# EAGLE schematic 030Card (EAGLE 8.2.2)
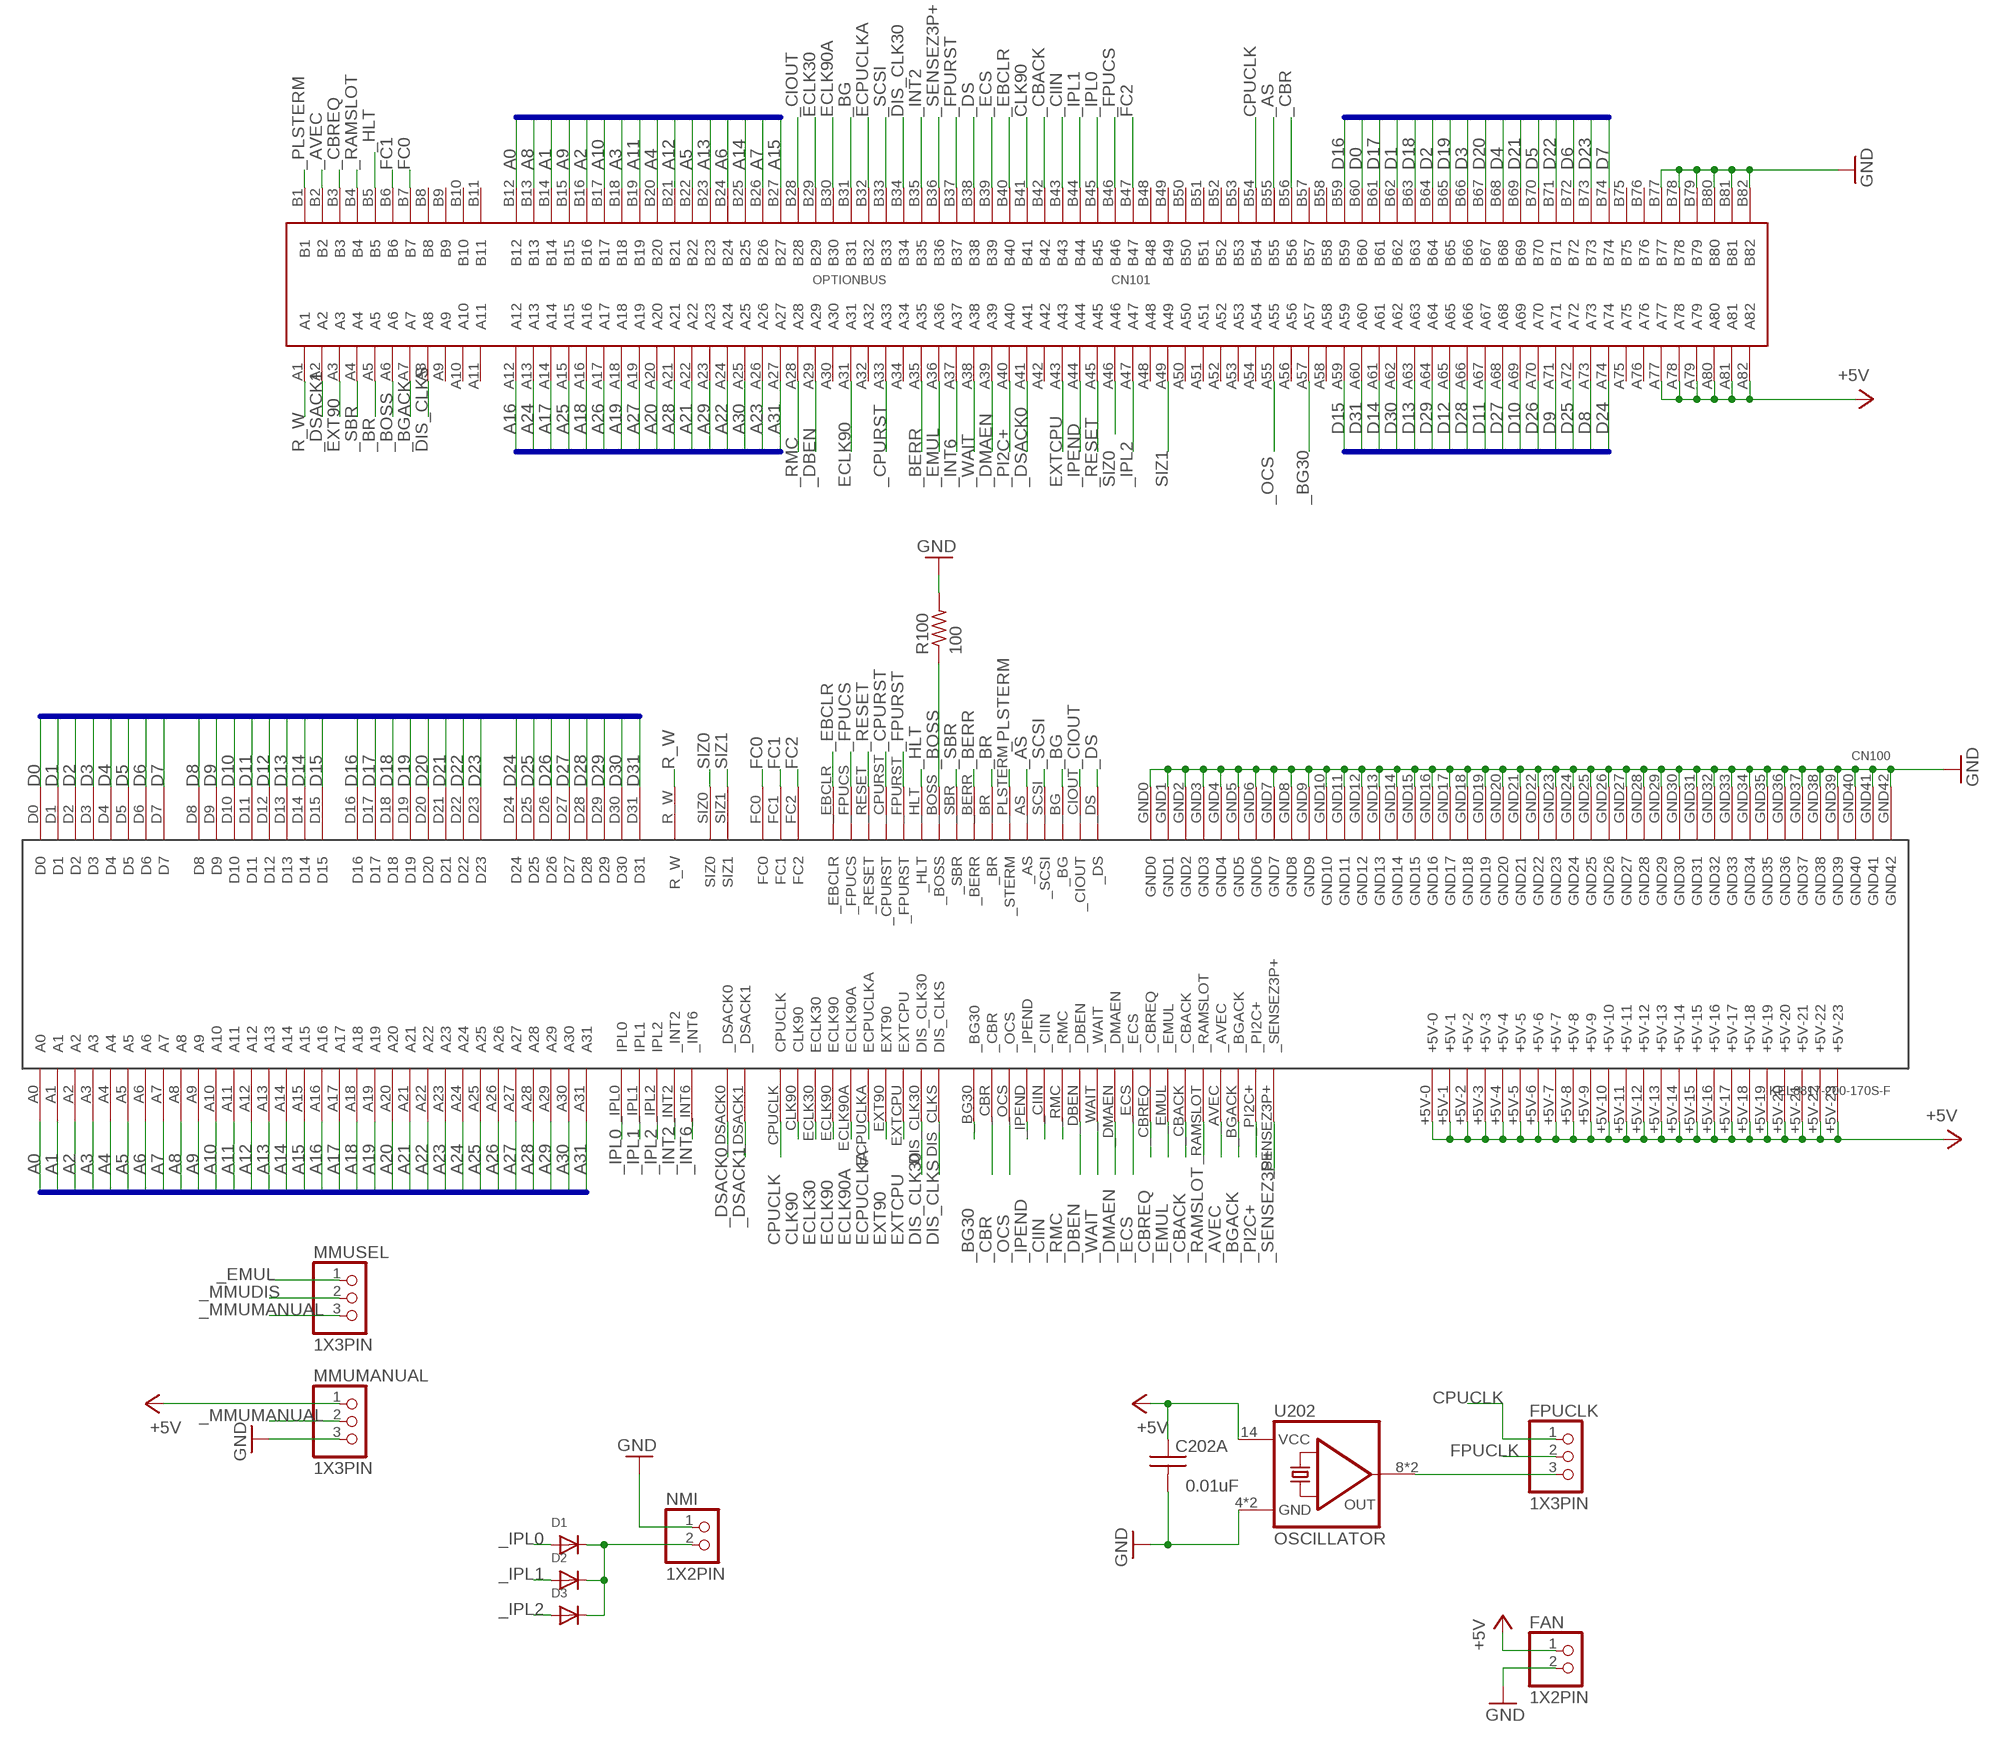
[diagram p0: schematic, sheet 1, part 1 of 2]
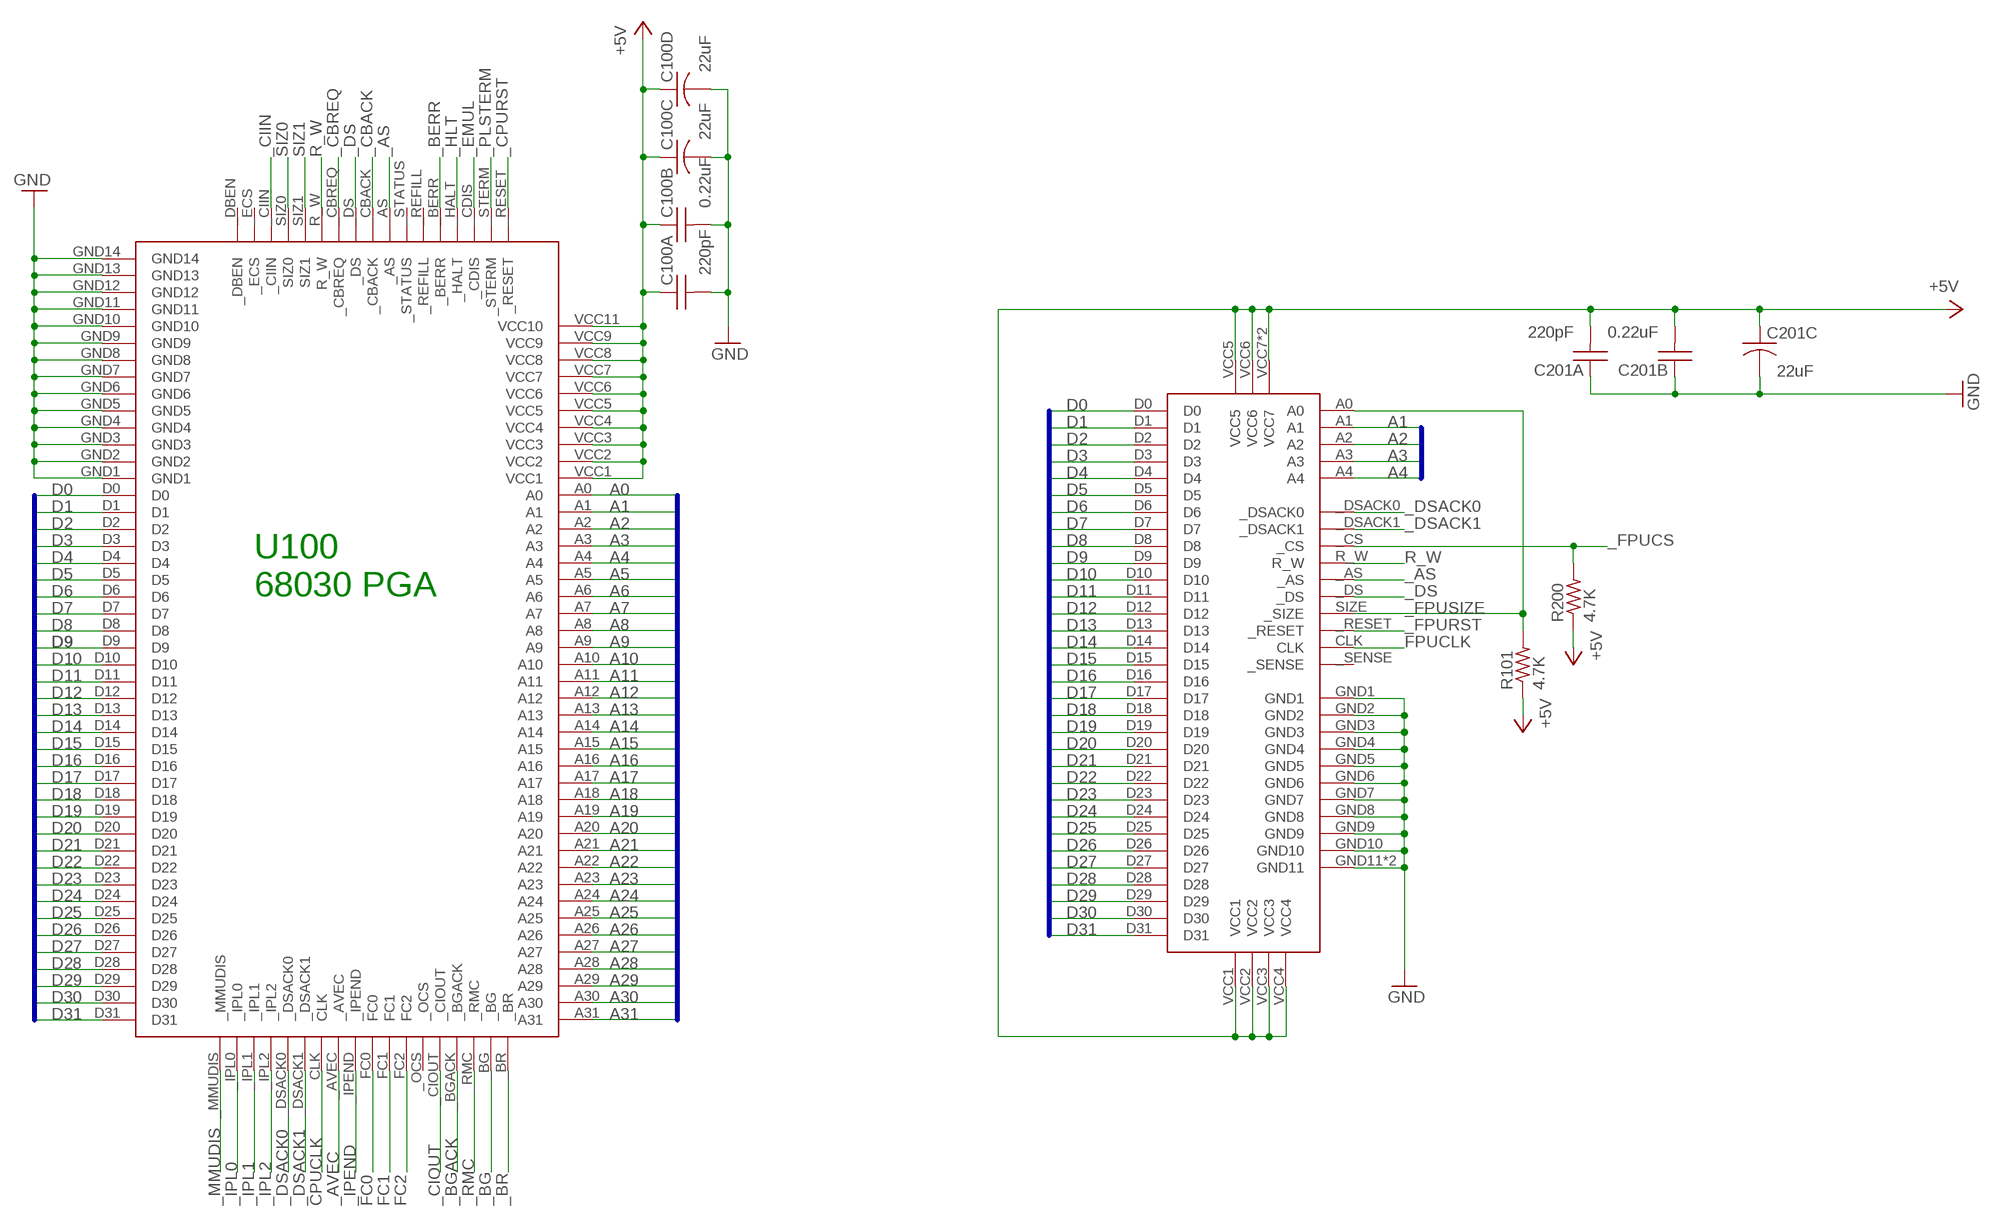
[diagram p1: schematic, sheet 1, part 2 of 2]

## Parts
C100A  220pF  C0805  [R0805]
C100B  0.22uF  C0805  [R0805]
C100C  22uF  SMD-ELECTROLYTE  [SMD-ELECTROLYTE]
C100D  22uF  SMD-ELECTROLYTE  [SMD-ELECTROLYTE]
C201A  220pF  C0805  [R0805]
C201B  0.22uF  C0805  [R0805]
C201C  22uF  SMD-ELECTROLYTE  [SMD-ELECTROLYTE]
C202A  0.01uF  C0805  [R0805]
CN100  KEL8817-200-170S-F  [KEL8817-200-170S-F]
CN101  OPTIONBUS  [OPTIONBUS]
D1  DIODESOD-323F  [SOD-323F]
D2  DIODESOD-323F  [SOD-323F]
D3  DIODESOD-323F  [SOD-323F]
FAN  1X2PIN  [1X2PIN]
FPUCLK  1X3PIN  [1X3PIN]
MMUMANUAL  1X3PIN  [1X3PIN]
MMUSEL  1X3PIN  [1X3PIN]
NMI  1X2PIN  [1X2PIN]
R100  100  R-US_R0805  [R0805]
R101  4.7K  R-US_R0805  [R0805]
R200  4.7K  R-US_R0805  [R0805]
U100  M68030  [M68030]
U201  M68882PLCC  [M68882PLCC]
U202  OSCILLATOR  [OSCILLATOR]

## Nets
+5V: C100A.1 C100B.1 C100C.+ C100D.+ C201A.2 C201B.2 C201C.+ C202A.1 CN100.+5V-0 CN100.+5V-1 CN100.+5V-2 CN100.+5V-3 CN100.+5V-4 CN100.+5V-5 CN100.+5V-6 CN100.+5V-7 CN100.+5V-8 CN100.+5V-9 CN100.+5V-10 CN100.+5V-11 CN100.+5V-12 CN100.+5V-13 CN100.+5V-14 CN100.+5V-15 CN100.+5V-16 CN100.+5V-17 CN100.+5V-18 CN100.+5V-19 CN100.+5V-20 CN100.+5V-21 CN100.+5V-22 CN100.+5V-23 CN101.A77 CN101.A78 CN101.A79 CN101.A80 CN101.A81 CN101.A82 FAN.1 MMUMANUAL.1 R101.1 R200.1 U100.VCC1 U100.VCC2 U100.VCC3 U100.VCC4 U100.VCC5 U100.VCC6 U100.VCC7 U100.VCC8 U100.VCC9 U100.VCC11(VCC10) U201.VCC1 U201.VCC2 U201.VCC3 U201.VCC4 U201.VCC5 U201.VCC6 U201.VCC7 U201.VCC8(VCC7) U202.14(+5V)
_AS: CN100._AS CN101.B55 U100._AS U201._AS
_AVEC: CN100._AVEC CN101.B2 U100._AVEC
_BERR: CN100._BERR CN101.A35 U100._BERR
_BG: CN100._BG CN101.B31 U100._BG
_BG30: CN100._BG30 CN101.A57
_BGACK: CN100._BGACK CN101.A7 U100._BGACK
_BOSS: CN100._BOSS CN101.A6 R100.1
_BR: CN100._BR CN101.A5 U100._BR
_CBACK: CN100._CBACK CN101.B42 U100._CBACK
_CBR: CN100._CBR CN101.B56
_CBREQ: CN100._CBREQ CN101.B3 U100._CBREQ
_CIIN: CN100._CIIN CN101.B43 U100._CIIN
_CIOUT: CN100._CIOUT CN101.B28 U100._CIOUT
_CPURST: CN100._CPURST CN101.A33 U100._RESET
_DBEN: CN100._DBEN CN101.A29
_DMAEN: CN100._DMAEN CN101.A39
_DS: CN100._DS CN101.B38 U100._DS U201._DS
_DSACK0: CN100._DSACK0 CN101.A41 U100._DSACK0 U201._DSACK0
_DSACK1: CN100._DSACK1 CN101.A2 U100._DSACK1 U201._DSACK1
_EBCLR: CN100._EBCLR CN101.B40
_ECS: CN100._ECS CN101.B39
_EMUL: CN100._EMUL CN101.A36 MMUSEL.1 U100._CDIS
_FPUCS: CN100._FPUCS CN101.B46 R200.2 U201._CS
_FPURST: CN100._FPURST CN101.B37 U201._RESET
_FPUSIZE: R101.2 U201.A0 U201.SIZE(_SIZE)
_HLT: CN100._HLT CN101.B5 U100._HALT
_INT2: CN100._INT2 CN101.B35
_INT6: CN100._INT6 CN101.A37
_IPEND: CN100._IPEND CN101.A44 U100._IPEND
_IPL0: CN100._IPL0(IPL0) CN101.B45 D1.A U100._IPL0
_IPL1: CN100._IPL1(IPL1) CN101.B44 D2.A U100._IPL1
_IPL2: CN100._IPL2(IPL2) CN101.A47 D3.A U100._IPL2
_MMUDIS: MMUSEL.2 U100._MMUDIS
_MMUMANUAL: MMUMANUAL.2 MMUSEL.3
_NMI: D1.C D2.C D3.C NMI.2
_OCS: CN100._OCS CN101.A55
_PI2C+: CN100._PI2C+ CN101.A40
_PLSTERM: CN100._PLSTERM(_STERM) CN101.B1 U100._STERM
_RAMSLOT: CN100._RAMSLOT CN101.B4
_RESET: CN100._RESET CN101.A45
_RMC: CN100._RMC CN101.A28 U100._RMC
_SBR: CN100._SBR CN101.A4
_SCSI: CN100._SCSI CN101.B33
_SENSEZ3P+: CN100._SENSEZ3P+ CN101.B36
_WAIT: CN100._WAIT CN101.A38
A0: CN100.A0 CN101.B12 U100.A0
A1: CN100.A1 CN101.B14 U100.A1 U201.A1
A2: CN100.A2 CN101.B16 U100.A2 U201.A2
A3: CN100.A3 CN101.B18 U100.A3 U201.A3
A4: CN100.A4 CN101.B20 U100.A4 U201.A4
A5: CN100.A5 CN101.B22 U100.A5
A6: CN100.A6 CN101.B24 U100.A6
A7: CN100.A7 CN101.B26 U100.A7
A8: CN100.A8 CN101.B13 U100.A8
A9: CN100.A9 CN101.B15 U100.A9
A10: CN100.A10 CN101.B17 U100.A10
A11: CN100.A11 CN101.B19 U100.A11
A12: CN100.A12 CN101.B21 U100.A12
A13: CN100.A13 CN101.B23 U100.A13
A14: CN100.A14 CN101.B25 U100.A14
A15: CN100.A15 CN101.B27 U100.A15
A16: CN100.A16 CN101.A12 U100.A16
A17: CN100.A17 CN101.A14 U100.A17
A18: CN100.A18 CN101.A16 U100.A18
A19: CN100.A19 CN101.A18 U100.A19
A20: CN100.A20 CN101.A20 U100.A20
A21: CN100.A21 CN101.A22 U100.A21
A22: CN100.A22 CN101.A24 U100.A22
A23: CN100.A23 CN101.A26 U100.A23
A24: CN100.A24 CN101.A13 U100.A24
A25: CN100.A25 CN101.A15 U100.A25
A26: CN100.A26 CN101.A17 U100.A26
A27: CN100.A27 CN101.A19 U100.A27
A28: CN100.A28 CN101.A21 U100.A28
A29: CN100.A29 CN101.A23 U100.A29
A30: CN100.A30 CN101.A25 U100.A30
A31: CN100.A31 CN101.A27 U100.A31
CLK90: CN100.CLK90 CN101.B41
CPUCLK: CN100.CPUCLK CN101.B54 FPUCLK.1 U100.CLK
D0: CN100.D0 CN101.B60 U100.D0 U201.D0
D1: CN100.D1 CN101.B62 U100.D1 U201.D1
D2: CN100.D2 CN101.B64 U100.D2 U201.D2
D3: CN100.D3 CN101.B66 U100.D3 U201.D3
D4: CN100.D4 CN101.B68 U100.D4 U201.D4
D5: CN100.D5 CN101.B70 U100.D5 U201.D5
D6: CN100.D6 CN101.B72 U100.D6 U201.D6
D7: CN100.D7 CN101.B74 U100.D7 U201.D7
D8: CN100.D8 CN101.A73 U100.D8 U201.D8
D9: CN100.D9 CN101.A71 U100.D9 U201.D9
D10: CN100.D10 CN101.A69 U100.D10 U201.D10
D11: CN100.D11 CN101.A67 U100.D11 U201.D11
D12: CN100.D12 CN101.A65 U100.D12 U201.D12
D13: CN100.D13 CN101.A63 U100.D13 U201.D13
D14: CN100.D14 CN101.A61 U100.D14 U201.D14
D15: CN100.D15 CN101.A59 U100.D15 U201.D15
D16: CN100.D16 CN101.B59 U100.D16 U201.D16
D17: CN100.D17 CN101.B61 U100.D17 U201.D17
D18: CN100.D18 CN101.B63 U100.D18 U201.D18
D19: CN100.D19 CN101.B65 U100.D19 U201.D19
D20: CN100.D20 CN101.B67 U100.D20 U201.D20
D21: CN100.D21 CN101.B69 U100.D21 U201.D21
D22: CN100.D22 CN101.B71 U100.D22 U201.D22
D23: CN100.D23 CN101.B73 U100.D23 U201.D23
D24: CN100.D24 CN101.A74 U100.D24 U201.D24
D25: CN100.D25 CN101.A72 U100.D25 U201.D25
D26: CN100.D26 CN101.A70 U100.D26 U201.D26
D27: CN100.D27 CN101.A68 U100.D27 U201.D27
D28: CN100.D28 CN101.A66 U100.D28 U201.D28
D29: CN100.D29 CN101.A64 U100.D29 U201.D29
D30: CN100.D30 CN101.A62 U100.D30 U201.D30
D31: CN100.D31 CN101.A60 U100.D31 U201.D31
DIS_CLK30: CN100.DIS_CLK30 CN101.B34
DIS_CLKS: CN100.DIS_CLKS CN101.A8
ECLK30: CN100.ECLK30 CN101.B29
ECLK90: CN100.ECLK90 CN101.A31
ECLK90A: CN100.ECLK90A CN101.B30
ECPUCLKA: CN100.ECPUCLKA CN101.B32
EXT90: CN100.EXT90 CN101.A3
EXTCPU: CN100.EXTCPU CN101.A43
EXTFPUCLK: FPUCLK.3 U202.8(OUT) U202.11(OUT)
FC0: CN100.FC0 CN101.B7 U100.FC0
FC1: CN100.FC1 CN101.B6 U100.FC1
FC2: CN100.FC2 CN101.B47 U100.FC2
FPUCLK: FPUCLK.2 U201.CLK
GND: C100A.2 C100B.2 C100C.- C100D.- C201A.1 C201B.1 C201C.- C202A.2 CN100.GND0 CN100.GND1 CN100.GND2 CN100.GND3 CN100.GND4 CN100.GND5 CN100.GND6 CN100.GND7 CN100.GND8 CN100.GND9 CN100.GND10 CN100.GND11 CN100.GND12 CN100.GND13 CN100.GND14 CN100.GND15 CN100.GND16 CN100.GND17 CN100.GND18 CN100.GND19 CN100.GND20 CN100.GND21 CN100.GND22 CN100.GND23 CN100.GND24 CN100.GND25 CN100.GND26 CN100.GND27 CN100.GND28 CN100.GND29 CN100.GND30 CN100.GND31 CN100.GND32 CN100.GND33 CN100.GND34 CN100.GND35 CN100.GND36 CN100.GND37 CN100.GND38 CN100.GND39 CN100.GND40 CN100.GND41 CN100.GND42 CN101.B77 CN101.B78 CN101.B79 CN101.B80 CN101.B81 CN101.B82 FAN.2 MMUMANUAL.3 NMI.1 R100.2 U100.GND1 U100.GND2 U100.GND3 U100.GND4 U100.GND5 U100.GND6 U100.GND7 U100.GND8 U100.GND9 U100.GND10 U100.GND11 U100.GND12 U100.GND13 U100.GND14 U201.GND1 U201.GND2 U201.GND3 U201.GND4 U201.GND5 U201.GND6 U201.GND7 U201.GND8 U201.GND9 U201.GND10 U201.GND11 U201.GND12(GND11) U202.4(GND) U202.7(GND)
R_W: CN100.R_W CN101.A1 U100.R_W U201.R_W
SIZ0: CN100.SIZ0 CN101.A46 U100.SIZ0
SIZ1: CN100.SIZ1 CN101.A49 U100.SIZ1
Unconnected: CN101.A9 CN101.A10 CN101.A11 CN101.A30 CN101.A32 CN101.A34 CN101.A42 CN101.A48 CN101.A50 CN101.A51 CN101.A52 CN101.A53 CN101.A54 CN101.A56 CN101.A58 CN101.A75 CN101.A76 CN101.B8 CN101.B9 CN101.B10 CN101.B11 CN101.B48 CN101.B49 CN101.B50 CN101.B51 CN101.B52 CN101.B53 CN101.B57 CN101.B58 CN101.B75 CN101.B76 U100._DBEN U100._ECS U100._OCS U100._REFILL U100._STATUS U201._SENSE

## Buses
D[0..31]
A[0..31]

## Notes on the sheet
- U100
  68030 PGA

## Library data of the parts
C100A C100B C201A C201B C202A = A3660:C0805
C100C C100D C201C = 030Card:SMD-ELECTROLYTE
CN100 = 030Card:KEL8817-200-170S-F: Original design by Edu Arana Pinout corrected and signals added by John Hertell
CN101 = 030Card:OPTIONBUS
D1-D3 = adafruit:DIODE: Diode SMADIODE - SMA Surface Mount Package 20V 1A Schottky Diode Digikey: 641-1014-6-ND DO-1N4148 - Through Hole Small Current Diode SOD-123 20V 1 A (.5mV Vf) Schottky Diode - Digikey: MBRX120TPMSCT-ND SOD-323 10V 570mA (.38mV Vf, 3ns) Schottky Diode - Digikey: ZLLS410CT-ND SOD-523 30V 30mA Schottky Diode (RB751S-40TE61) - Digikey: RB751S-40TE61CT-ND SOT23-R/W - SOT23 Package (R = Solder Paste/Reflow Ovens, W = Hand-Soldering) BAT54Film 40V 300mA - Digikey: 497-7162-1-ND
FAN NMI = 030Card:1X2PIN
FPUCLK MMUMANUAL MMUSEL = 030Card:1X3PIN
R100 R101 R200 = adafruit:R-US_: RESISTOR, American symbol
U100 = 030Card:M68030
U201 = 030Card:M68882PLCC
U202 = 030Card:OSCILLATOR